# Altium schematic sheet Schield_elkapod.SchDoc
size A4; SheetNumber: 1; SheetTotal: 6
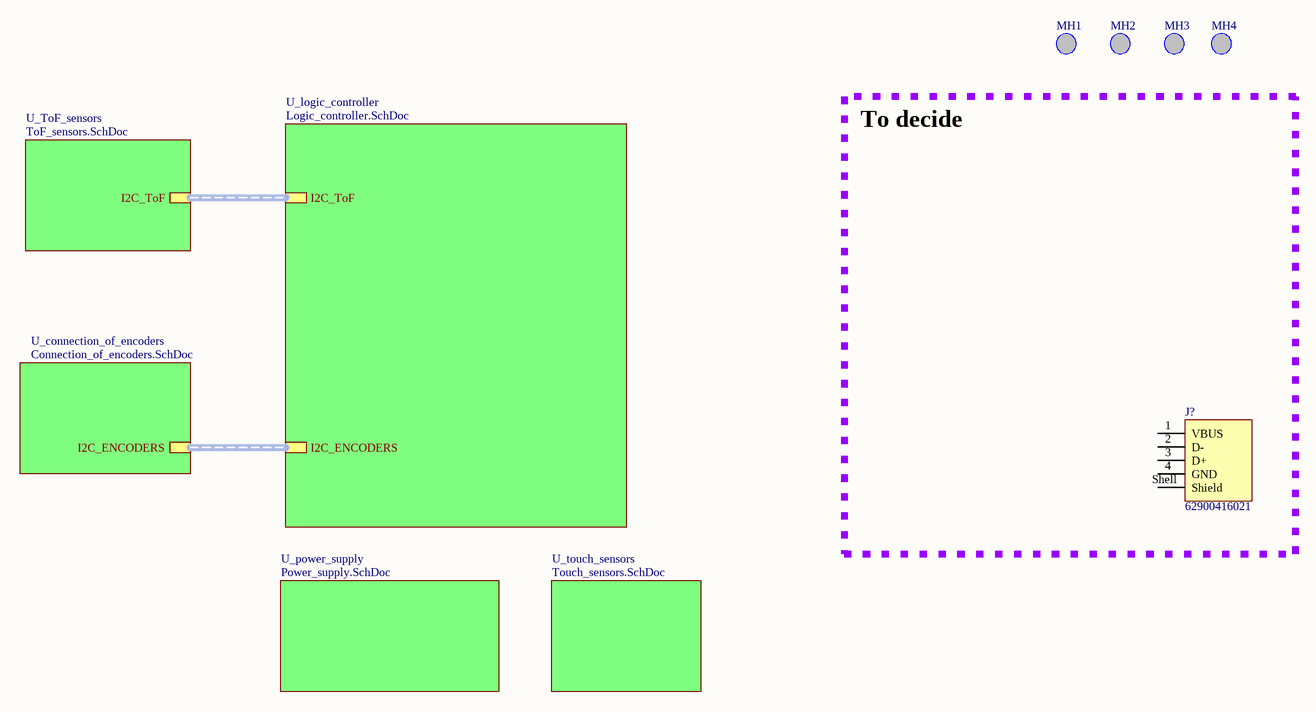
[diagram p0: Schield_elkapod.SchDoc]

## Parts
J?  62900416021  [62900416021]
MH1  mounting hole  [MH?]  (value not drawn)
MH2  mounting hole  [MH?]  (value not drawn)
MH3  mounting hole  [MH?]  (value not drawn)
MH4  mounting hole  [MH?]  (value not drawn)

## Blocks framed on the sheet
To decide: J?

## Sub-sheets
U_connection_of_encoders = Connection_of_encoders.SchDoc: I2C_ENCODERS (harness I2C_MULTIPLEXERS)
U_logic_controller = Logic_controller.SchDoc: I2C_ENCODERS (harness I2C_MULTIPLEXERS), I2C_ToF
U_power_supply = Power_supply.SchDoc: no entries
U_ToF_sensors = ToF_sensors.SchDoc: I2C_ToF
U_touch_sensors = Touch_sensors.SchDoc: no entries

## Nets

Not connected (* = marked no-connect by the designer): J? 1(VBUS) 2(D-) 3(D+) 4(GND) Shell(Shield)

## Buses and harness runs
harness sheet U_connection_of_encoders/I2C_ENCODERS = sheet U_logic_controller/I2C_ENCODERS
harness sheet U_logic_controller/I2C_ToF = sheet U_ToF_sensors/I2C_ToF

## Library data of the parts
J? = CMP-1502-03240-2: NexarPartId: 19991170; Number of Contacts: 4; Insulation Resistance: 1GΩ; Connector Type: USB; Contact Resistance: 20mΩ; Gender: Receptacle; Current Rating: 1.5A; Operating Supply Voltage: 30V; USB Standard: USB 2.0; Packaging: Cut Tape; Contact Plating: Gold; REACH SVHC: Unknown; Orientation: Horizontal; RoHS: Compliant; Features: Shielded; Length: 14.4mm; Max Operating Temperature: 105°C; Number of Pins: 4; Termination: SMD/SMT; Lead Free: Lead Free; Min Operating Temperature: -40°C; Mount: Horizontal, Surface Mount
MH1 = CMP-00030-00006-7: mounting hole 3mm padded
MH2 MH4 = CMP-00030-00006-7: Mmounting hole 3mm padded
MH3 = CMP-00030-00006-7: MHmounting hole 3mm padded